# EAGLE schematic prostownik_1k2p (EAGLE 9.0.1)
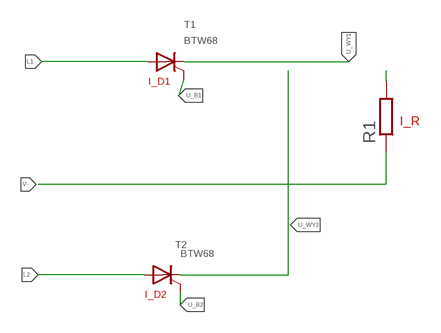
[diagram p0: schematic, sheet 1]

## Parts
R1  R-EU_0309/12  [0309/12]
T1  BTW68  [TOP3S-2]
T2  BTW68  [TOP3S-2]

## Nets
L1: T1.A
L2: T2.A
U_B1: T1.G
U_B2: T2.G
U_WY: R1.2
U_WY1: T1.C
U_WY2: T2.C
V-: R1.1

## Library data of the parts
R1 = rcl:R-EU_: RESISTOR, European symbol; SPICEPREFIX: R
T1 T2 = triac:BTW68: THYRISTOR